# Altium schematic sheet Surf5_R110.SchDoc: Surf5
size A3; DrawnBy: Jaden; Revision: 1.0; SheetNumber: 1; SheetTotal: 1
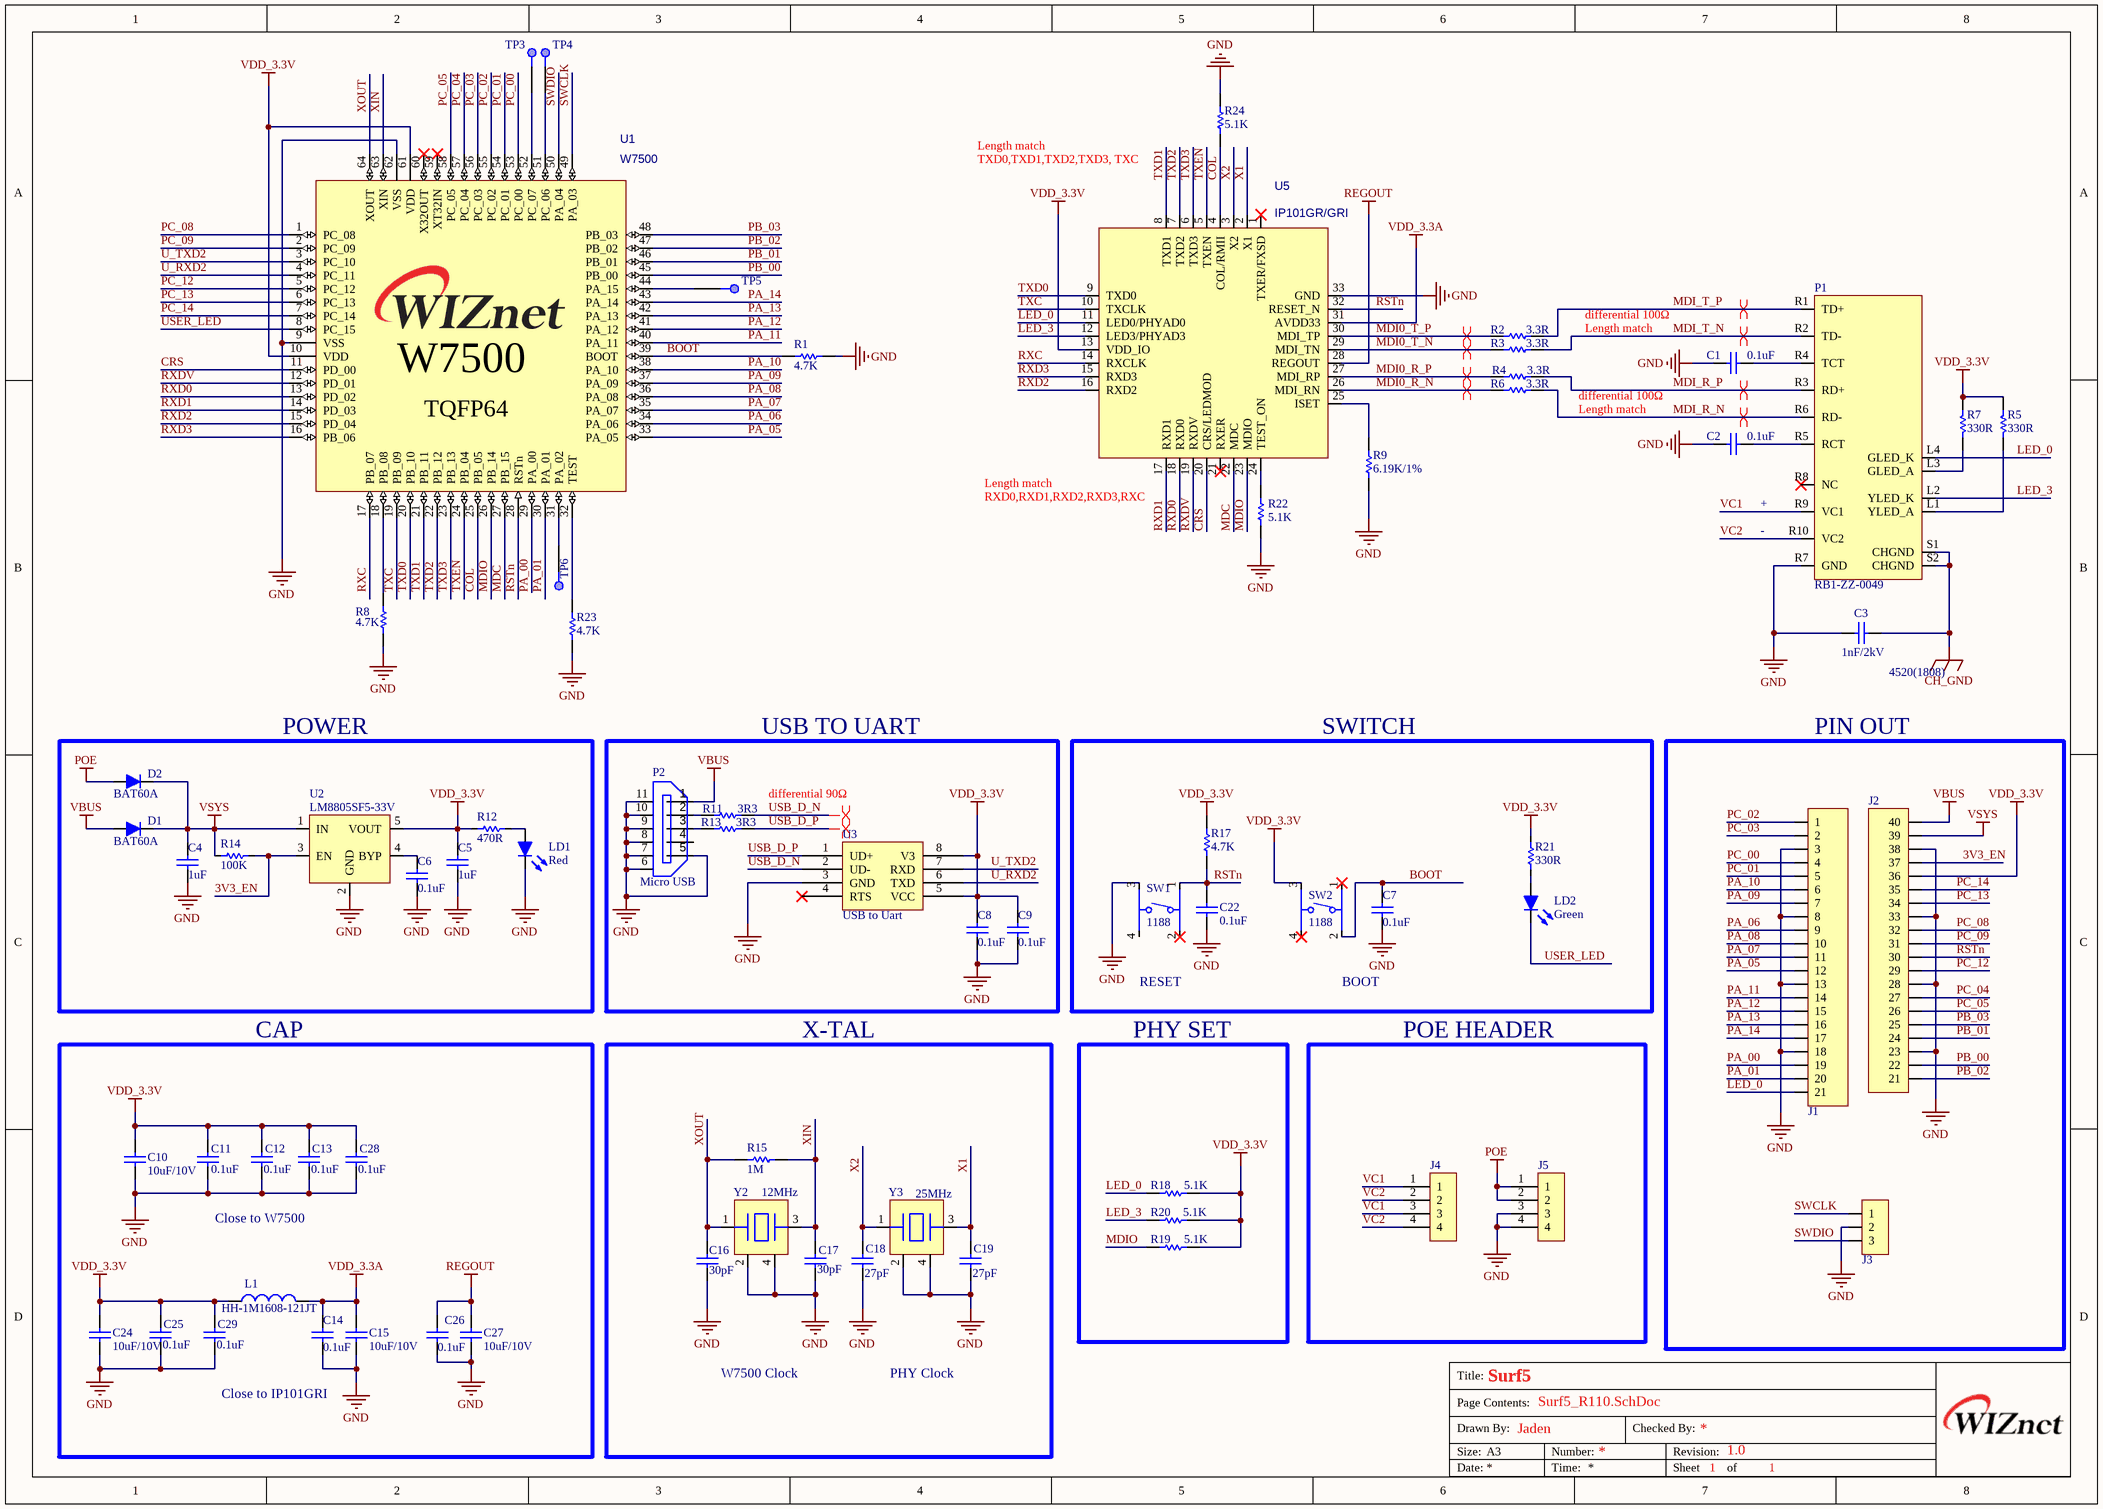
[diagram p0: Surf5_R110.SchDoc]

## Parts
C1  0.1uF  [CAP-0402]
C2  0.1uF  [CAP-0402]
C3  1nF/2kV  [CAP-1808]
C4  1uF  [CAP-0402]
C5  1uF  [CAP-0402]
C6  0.1uF  [CAP-0402]
C7  0.1uF  [CAP-0402]
C8  0.1uF  [CAP-0402]
C9  0.1uF  [CAP-0402]
C10  10uF/10V  [CAP-0805-3]
C11  0.1uF  [CAP-0402]
C12  0.1uF  [CAP-0402]
C13  0.1uF  [CAP-0402]
C14  0.1uF  [CAP-0402]
C15  10uF/10V  [CAP-0805-3]
C16  30pF  [CAP-0402]
C17  30pF  [CAP-0402]
C18  27pF  [CAP-0402]
C19  27pF  [CAP-0402]
C22  0.1uF  [CAP-0402]
C24  10uF/10V  [CAP-0805-3]
C25  0.1uF  [CAP-0402]
C26  0.1uF  [CAP-0402]
C27  10uF/10V  [CAP-0805-3]
C28  0.1uF  [CAP-0402]
C29  0.1uF  [CAP-0402]
D1  BAT60A  [SOD-323(1-C,2-A)]
D2  BAT60A  [SOD-323(1-C,2-A)]
J1  2.54mm 1x21 Pin Header DIP  [IDC-1X21]  (value not drawn)
J2  2.54mm 1x20 Pin Header DIP  [IDC-1X20]  (value not drawn)
J3  2.54mm 1x3 Pin Header DIP  [IDC-1X3]  (value not drawn)
J4  Header Socket 1x4_2.54mm  [Header-Socket(DIP)_4x1_2.54mm]  (value not drawn)
J5  Header Socket 1x4_2.54mm  [Header-Socket(DIP)_4x1_2.54mm]  (value not drawn)
L1  HH-1M1608-121JT  [IND-0603]
LD1  Red  [LED-0603-RED]
LD2  Green  [LED-0603-RED]
P1  RB1-ZZ-0049  [RB1-ZZ-0049]
P2  Micro USB  [Micro 5P B DBX 6.4]
R1  4.7K  [RES-0402]
R2  3.3R  [RES-0402]
R3  3.3R  [RES-0402]
R4  3.3R  [RES-0402]
R5  330R  [RES-0402]
R6  3.3R  [RES-0402]
R7  330R  [RES-0402]
R8  4.7K  [RES-0402]
R9  6.19K/1%  [RES-0402]
R11  3R3  [RES-0402]
R12  470R  [RES-0402]
R13  3R3  [RES-0402]
R14  100K  [RES-0402]
R15  1M  [RES-0402]
R17  4.7K  [RES-0402]
R18  5.1K  [RES-0402]
R19  5.1K  [RES-0402]
R20  5.1K  [RES-0402]
R21  330R  [RES-0402]
R22  5.1K  [RES-0402]
R23  4.7K  [RES-0402]
R24  5.1K  [RES-0402]
SW1  1188  [TS204225WT160SMTTR]
SW2  1188  [TS204225WT160SMTTR]
TP3  TPS  [TPS]  (value not drawn)  (no BOM)
TP4  TPS  [TPS]  (value not drawn)  (no BOM)
TP5  TPS  [TPS]  (value not drawn)  (no BOM)
TP6  TPS  [TPS]  (value not drawn)  (no BOM)
U1  W7500  [W7500-LQFP64]
U2  LM8805SF5-33V  [SOT-23-5L]
U3  USB to Uart  [CH340N]
U5  IP101GR/GRI  [QFN32(0.4/4X4)]
Y2  12MHz  [OSC-TZ1067B]
Y3  25MHz  [OSC-82J0626]

## Blocks framed on the sheet
POWER: C4-C6 D1 D2 LD1 R12 R14 U2
USB TO UART: C8 C9 P2 R11 R13 U3
SWITCH: C7 C22 LD2 R17 R21 SW1 SW2
PIN OUT: J1-J3
CAP: C10-C15 C24-C29 L1
X-TAL: C16-C19 R15 Y2 Y3
PHY SET: R18-R20
POE HEADER: J4 J5

## Nets
CH_GND: C3.2 P1.S1(CHGND) P1.S2(CHGND)
GND: C1.1 C2.1 C3.1 C4.1 C5.1 C6.1 C7.1 C8.1 C9.1 C10.1 C11.1 C12.1 C13.1 C14.1 C15.1 C16.1 C17.1 C18.1 C19.1 C22.2 C24.1 C25.1 C26.1 C27.1 C28.1 C29.1 J1.3 J1.8 J1.13 J1.18 J2.3(23) J2.8(28) J2.13(33) J2.18(38) J3.2 J5.3 J5.4 LD1.2(K) P1.R7(GND) P2.5 P2.6 P2.7 P2.8 P2.9 P2.10 P2.11 R1.1 R8.1 R9.1 R22.1 R23.2 R24.2 SW1.3 U1.9(VSS) U1.62(VSS) U2.2(GND) U3.3(GND) U5.33(GND) Y2.2 Y2.4 Y3.2 Y3.4
POE: D2.2(A) J5.1 J5.2
REGOUT: C26.2 C27.2 U5.28(REGOUT)
VBUS: D1.2(A) J2.20(40) P2.1
VDD_3.3A: C14.2 C15.2 L1.2 U5.31(AVDD33)
VDD_3.3V: C5.2 C8.2 C9.2 C10.2 C11.2 C12.2 C13.2 C24.2 C25.2 C28.2 C29.2 J2.16(36) L1.1 R5.1 R7.1 R12.1 R17.1 R18.2 R19.2 R20.2 R21.2 SW2.3 U1.10(VDD) U1.61(VDD) U2.5(VOUT) U3.5(VCC) U3.8(V3) U5.13(VDD_IO)
VSYS: C4.2 D1.1(K) D2.1(K) J2.19(39) R14.1 U2.1(IN)
3V3_EN: J2.17(37) R14.2 U2.3(EN)
BOOT: C7.2 R1.2 SW2.2 U1.39(BOOT)
COL: R24.1 U1.25(PB_05) U5.4(COL/RMII)
CRS: U1.11(PD_00) U5.20(CRS/LEDMOD)
LED_0: J1.21 P1.L4(GLED_K) R18.1 U5.11(LED0/PHYAD0)
LED_3: P1.L2(YLED_K) R20.1 U5.12(LED3/PHYAD3)
MDC: U1.27(PB_15) U5.22(MDC)
MDI0_R_N: R6.1 U5.26(MDI_RN)
MDI0_R_P: R4.1 U5.27(MDI_RP)
MDI0_T_N: R3.1 U5.29(MDI_TN)
MDI0_T_P: R2.1 U5.30(MDI_TP)
MDI_R_N: P1.R6(RD-) R6.2
MDI_R_P: P1.R3(RD+) R4.2
MDI_T_N: P1.R2(TD-) R3.2
MDI_T_P: P1.R1(TD+) R2.2
MDIO: R19.1 U1.26(PB_14) U5.23(MDIO)
PA_00: J1.19 U1.29(PA_00)
PA_01: J1.20 U1.30(PA_01)
PA_05: J1.12 U1.33(PA_05)
PA_06: J1.9 U1.34(PA_06)
PA_07: J1.11 U1.35(PA_07)
PA_08: J1.10 U1.36(PA_08)
PA_09: J1.7 U1.37(PA_09)
PA_10: J1.6 U1.38(PA_10)
PA_11: J1.14 U1.40(PA_11)
PA_12: J1.15 U1.41(PA_12)
PA_13: J1.16 U1.42(PA_13)
PA_14: J1.17 U1.43(PA_14)
PB_00: J2.2(22) U1.45(PB_00)
PB_01: J2.4(24) U1.46(PB_01)
PB_02: J2.1(21) U1.47(PB_02)
PB_03: J2.5(25) U1.48(PB_03)
PC_00: J1.4 U1.53(PC_00)
PC_01: J1.5 U1.54(PC_01)
PC_02: J1.1 U1.55(PC_02)
PC_03: J1.2 U1.56(PC_03)
PC_04: J2.7(27) U1.57(PC_04)
PC_05: J2.6(26) U1.58(PC_05)
PC_08: J2.12(32) U1.1(PC_08)
PC_09: J2.11(31) U1.2(PC_09)
PC_12: J2.9(29) U1.5(PC_12)
PC_13: J2.14(34) U1.6(PC_13)
PC_14: J2.15(35) U1.7(PC_14)
RSTn: C22.1 J2.10(30) R17.2 SW1.1 U1.28(RSTn) U5.32(RESET_N)
RXC: U1.17(PB_07) U5.14(RXCLK)
RXD0: U1.13(PD_02) U5.18(RXD0)
RXD1: U1.14(PD_03) U5.17(RXD1)
RXD2: U1.15(PD_04) U5.16(RXD2)
RXD3: U1.16(PB_06) U5.15(RXD3)
RXDV: U1.12(PD_01) U5.19(RXDV)
SWCLK: J3.1 U1.49(PA_03)
SWDIO: J3.3 U1.50(PA_04)
TXC: U1.19(PB_09) U5.10(TXCLK)
TXD0: U1.20(PB_10) U5.9(TXD0)
TXD1: U1.21(PB_11) U5.8(TXD1)
TXD2: U1.22(PB_12) U5.7(TXD2)
TXD3: U1.23(PB_13) U5.6(TXD3)
TXEN: U1.24(PB_04) U5.5(TXEN)
U_RXD2: U1.4(PC_11) U3.6(TXD)
U_TXD2: U1.3(PC_10) U3.7(RXD)
USB_D_N: R11.2 U3.2(UD-)
USB_D_P: R13.2 U3.1(UD+)
USER_LED: LD2.2(K) U1.8(PC_15)
VC1: J4.1 J4.3 P1.R9(VC1)
VC2: J4.2 J4.4 P1.R10(VC2)
X1: C19.2 U5.2(X1) Y3.3
X2: C18.2 U5.3(X2) Y3.1
XIN: C17.2 R15.2 U1.63(XIN) Y2.3
XOUT: C16.2 R15.1 U1.64(XOUT) Y2.1
NetC1_2: C1.2 P1.R4(TCT)
NetC2_2: C2.2 P1.R5(RCT)
NetC6_2: C6.2 U2.4(BYP)
NetLD1_1: LD1.1(A) R12.2
NetLD2_1: LD2.1(A) R21.1
NetP1_L1: P1.L1(YLED_A) R5.2
NetP1_L3: P1.L3(GLED_A) R7.2
NetP2_2: P2.2 R11.1
NetP2_3: P2.3 R13.1
NetR8_2: R8.2 U1.18(PB_08)
NetR9_2: R9.2 U5.25(ISET)
NetR22_2: R22.2 U5.24(TEST_ON)
NetR23_1: R23.1 U1.32(TEST)
NetTP3_1: TP3.1 U1.52(PC_07)
NetTP4_1: TP4.1 U1.51(PC_06)
NetTP5_1: TP5.1 U1.44(PA_15)
NetTP6_1: TP6.1 U1.31(PA_02)

Not connected (* = marked no-connect by the designer): P1 R8(NC)*; P2 4; SW1 2* 4; SW2 1* 4*; U1 59(XT32IN)* 60(X32OUT)*; U3 4(RTS)*; U5 1(TXER/FXSD)* 21(RXER)*

## Layout directives
differential pair: MDI0_R_N, MDI0_R_P, MDI0_T_N, MDI0_T_P, MDI_R_N, MDI_R_P, MDI_T_N, MDI_T_P, USB_D_N, USB_D_P

## Notes on the sheet
- Length match
- TXD0,TXD1,TXD2,TXD3, TXC
- differential 100Ω
- (near U5) Length match
- (near U5) RXD0,RXD1,RXD2,RXD3,RXC
- +
- (near P1) -
- (near C3) 4520(1808)
- differential 90Ω
- RESET
- BOOT
- Close to W7500
- Close to IP101GRI
- W7500 Clock
- PHY Clock
- Title:
- Page Contents:
- Size:
- Date:
- Drawn By:
- A3
- Number:
- Time:
- Checked By:
- Revision:
- Sheet
- of
- (in symbol W7500) TQFP64

## Library data of the parts
C1 C2 C4-C9 C11-C14 C16-C19 C22 C25 C26 C28 C29 = CAP-0402: Ceramic CAP 0402(1005)
C3 = CAP-1808: Ceramic CAP 1808(4520)
C10 C15 C24 C27 = CAP-0805: MLCC-0805(2012)
D1 D2 = DIODE-BAT60A: Silicon Schottky Diode
J4 J5 = Header Socket 1x4_2.54mm: Connector; Manufacturer_Name: Harwin; Manufacturer_Part_Number: M20-7820442; Datasheet Link: https://cdn.harwin.com/pdfs/M20-782.pdf; Height: 8.65mm; Mouser Part Number: 855-M20-7820442; Mouser Price/Stock: https://www.mouser.co.uk/ProductDetail/Harwin/M20-7820442?qs=vF78I%252BjhbY9ZgDLCXkGx4w%3D%3D
L1 = IND-0603: Inductor 0603(1608)
LD1 LD2 = LED-0603
P1 = RB1-ZZ-0049: PoE RJ45
P2 = Micro USB 5P DBX6.4: Micro USB B Connector SMD
R1-R9 R11-R15 R17-R24 = RES-0402
SW1 SW2 = 1188: Switch; Manufacturer_Name: CUI Devices; Manufacturer_Part_Number: TS20-42-25-WT-160-SMT-TR; Datasheet Link: https://www.cuidevices.com/product/resource/ts20.pdf; Height: 2.7mm; Mouser Part Number: 179-TS204225WT160SMT; Mouser Price/Stock: https://www.mouser.co.uk/ProductDetail/CUI-Devices/TS20-42-25-WT-160-SMT-TR?qs=tlsG%2FOw5FFiXbig16X7ymQ%3D%3D; Arrow Part Number: TS20-42-25-WT-160-SMT-TR; Arrow Price/Stock: https://www.arrow.com/en/products/ts20-42-25-wt-160-smt-tr/cui-devices?region=nac
TP3-TP6 = TPS: Test_point; Manufacturer: Wurth Elektronik; Part Number: 61300211121; Rated Current: 3A; Gender: Male; Withstanding Voltage: 500VAC; Working Voltage: 250VAC; Pitch: 2.54mm; Contact Resistance: 20mOhm; Row Number: Single; Pin Number: 2; Mounting Technology: THT; Orientation: Vertical; Operating Temperature: -40to105degC; Packaging: Bag; Publisher: WurthElektronik; Datasheet URL: https://katalog.we-online.de/em/datasheet/6130xx11121.pdf; Manufacturer URL: http://www.we-online.de; Package Reference: 61300211121
U1 = W7500: WIZnet ARM Cortex-M0
U2 = LM8805SF5-33V: 600mA CMOS LDO Regulator
U3 = CH340N
U5 = IP101GR/GRI: Pakage: VQFN-32; Part_name: IP101GR/GRI
Y2 = OSC-TZ1067B-12MHz: X-tal 12MHz,3.2x2.5 SMD, CL=20pF
Y3 = OSC-82J0626-25MHz: X-tal 25MHz,3.2x2.5 SMD, CL=18pF